# EAGLE schematic brick_i2c_oled (EAGLE 7.4.0)
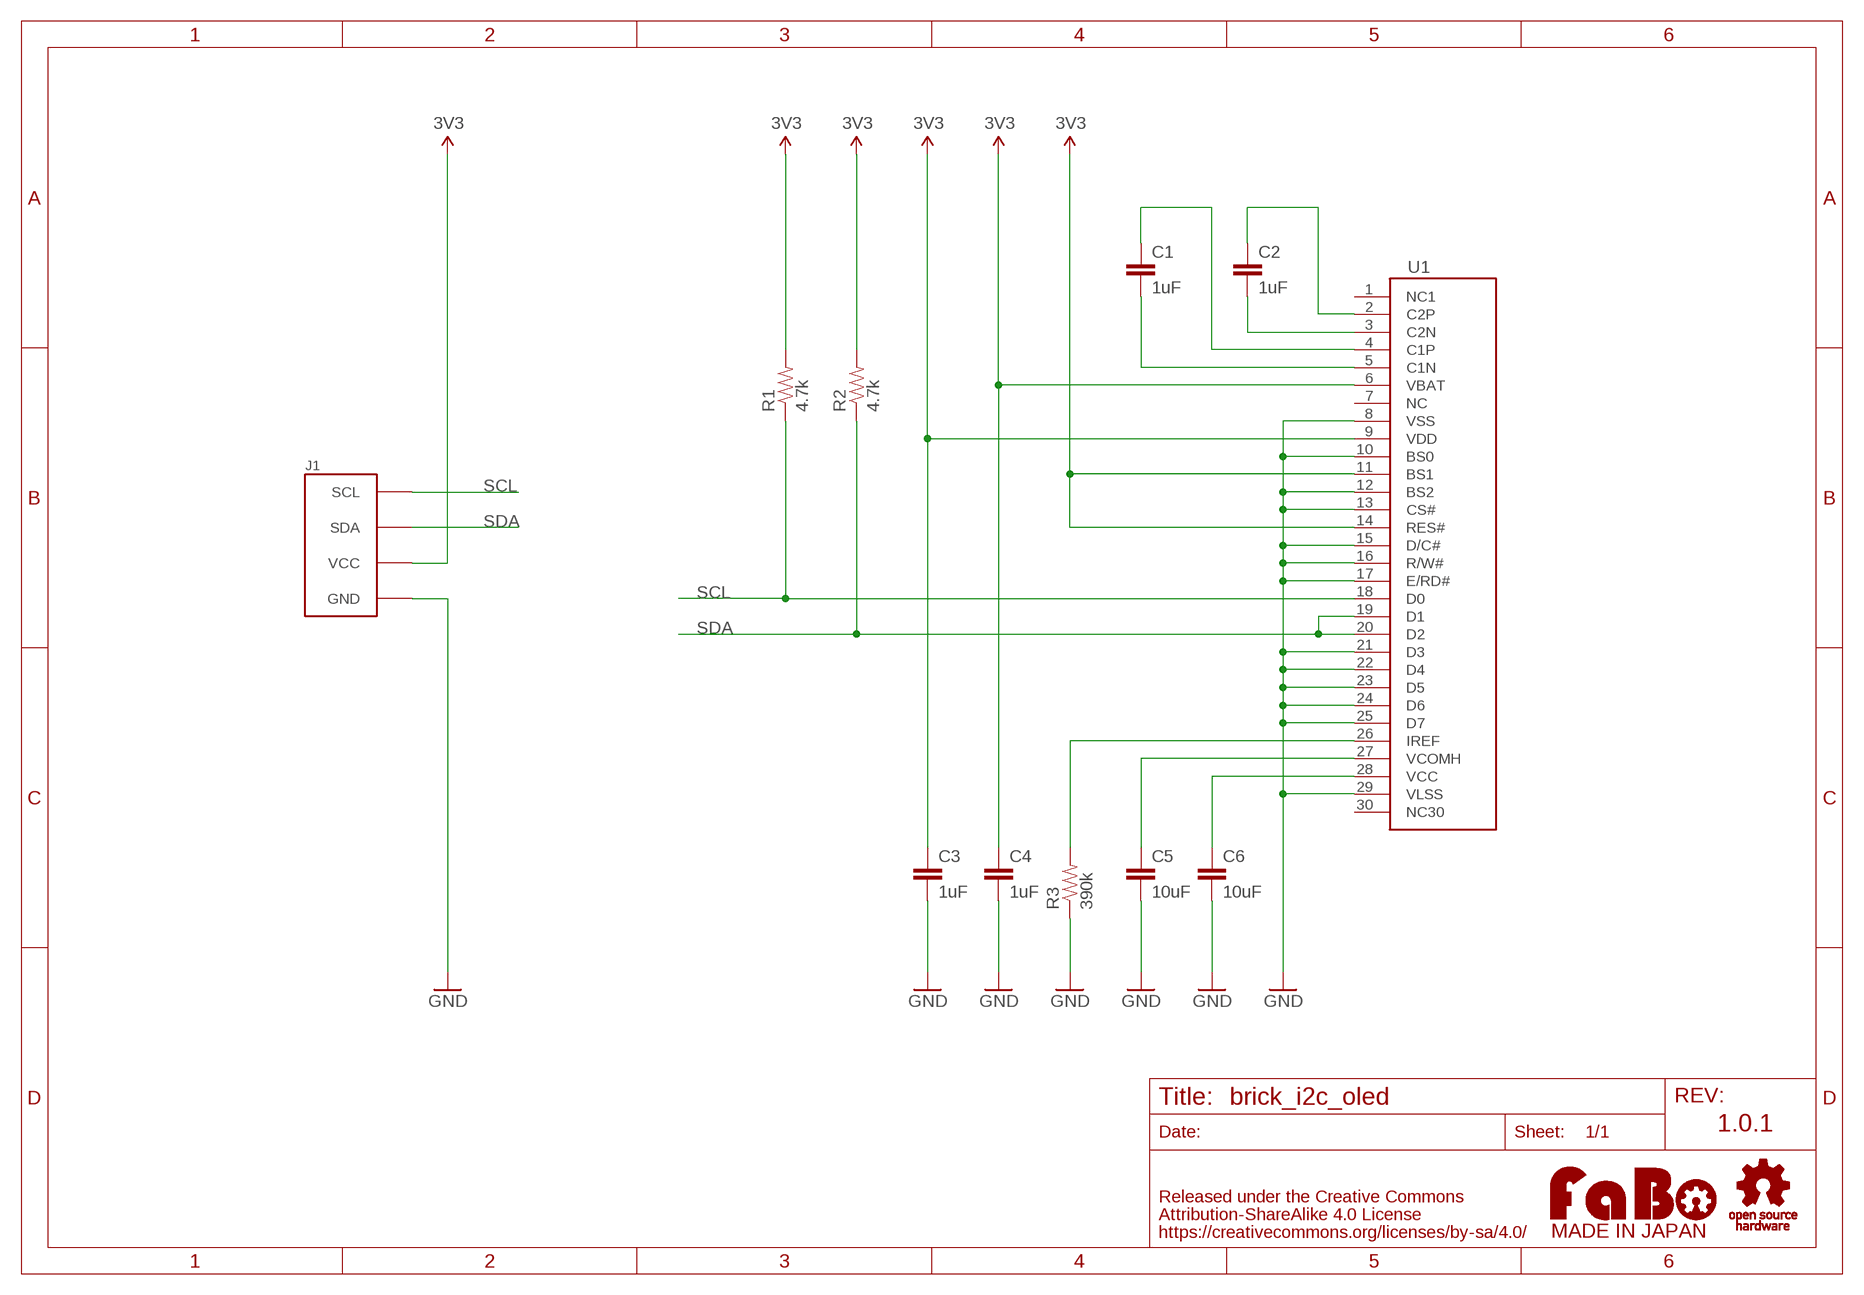
[diagram p0: schematic, sheet 1]

## Parts
C1  1uF  CAP-EIA0603  [EIA0603]
C2  1uF  CAP-EIA0603  [EIA0603]
C3  1uF  CAP-EIA0603  [EIA0603]
C4  1uF  CAP-EIA0603  [EIA0603]
C5  10uF  CAP-EIA0603  [EIA0603]
C6  10uF  CAP-EIA0603  [EIA0603]
J1  FABO_BRICK_I2C  [FABO_BRICK_I2C]
R1  4.7k  RES-EIA0603  [EIA0603]
R2  4.7k  RES-EIA0603  [EIA0603]
R3  390k  RES-EIA0603  [EIA0603]
U1  ER-OLED0.96-1  [ER-OLED0.96-1]
U$2  LOGO_OSHW-T_M  [LOGO_OSHW_T_M]
U$3  LOGO_FABO-M  [LOGO_FABO_M]

## Nets
3V3: C3.1 C4.1 J1.VCC R1.2 R2.2 U1.6(VBAT) U1.9(VDD) U1.11(BS1) U1.14(RES#)
GND: C3.2 C4.2 C5.2 C6.2 J1.GND R3.1 U1.8(VSS) U1.10(BS0) U1.12(BS2) U1.13(CS#) U1.15(D/C#) U1.16(R/W#) U1.17(E/RD#) U1.21(D3) U1.22(D4) U1.23(D5) U1.24(D6) U1.25(D7) U1.29(VLSS)
N$1: C2.1 U1.2(C2P)
N$2: C2.2 U1.3(C2N)
N$3: C1.1 U1.4(C1P)
N$4: C1.2 U1.5(C1N)
N$5: C6.1 U1.28(VCC)
N$6: C5.1 U1.27(VCOMH)
N$7: R3.2 U1.26(IREF)
SCL: J1.SCL R1.1 U1.18(D0)
SDA: J1.SDA R2.1 U1.19(D1) U1.20(D2)
Unconnected: U1.1(NC1) U1.7(NC) U1.30(NC30)

## Notes on the sheet
- 1.0.1

## Library data of the parts
C1-C6 = FaBo-etc:CAP: Capacitor Standard 0603 ceramic capacitor
J1 = FaBo-Template:FABO_BRICK_I2C: FaBo Brick I2C
R1-R3 = FaBo-etc:RES
U1 = FaBo-Parts:ER-OLED0.96-1
U$2 = FaBo-etc:LOGO_OSHW
U$3 = FaBo-etc:LOGO_FABO